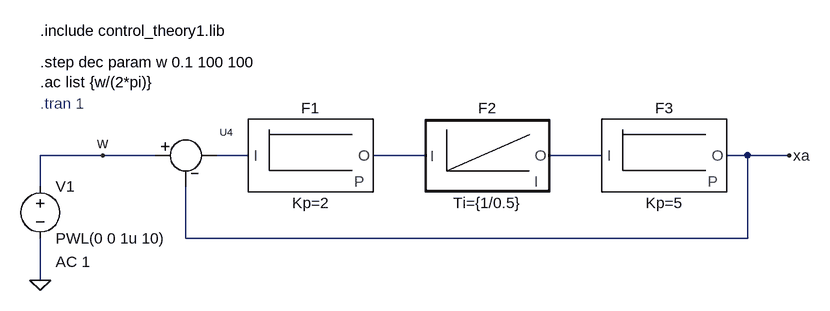
[diagram p0: schematic Aufgabe1_w.asc]
Aufgabe1_w.asc, the LTspice schematic file:
Version 4
SHEET 1 880 680
WIRE -256 128 -352 128
WIRE -176 128 -256 128
WIRE -32 128 -80 128
WIRE 240 128 160 128
WIRE 512 128 432 128
WIRE 736 128 704 128
WIRE 800 128 736 128
WIRE -352 176 -352 128
WIRE -128 256 -128 176
WIRE 736 256 736 128
WIRE 736 256 -128 256
WIRE -352 320 -352 256
FLAG -352 320 0
FLAG 800 128 xa
FLAG -256 128 w
SYMBOL ct___p 64 128 R0
SYMATTR InstName F1
SYMATTR Value Kp=2
SYMBOL ct___p 608 128 R0
SYMATTR InstName F3
SYMATTR Value Kp=5
SYMBOL ct___i 336 128 R0
SYMATTR InstName F2
SYMATTR Value Ti={1/0.5}
SYMBOL ct___sub -128 128 R0
SYMATTR InstName U4
SYMBOL voltage -352 160 R0
WINDOW 123 24 132 Left 0
WINDOW 39 0 0 Left 0
SYMATTR Value2 AC 1
SYMATTR InstName V1
SYMATTR Value PWL(0 0 1u 10)
TEXT -352 48 Left 0 ;.tran 1
TEXT -352 -64 Left 0 !.include control_theory1.lib
TEXT -352 -16 Left 0 !.step dec param w 0.1 100 100\n.ac list {w/(2*pi)}

The netlist it stands for:
* Aufgabe1_w.asc
XF1 N001 N002 CT___P Kp=2  ; pins in out
XF3 N003 xa CT___P Kp=5  ; pins in out
XF2 N002 N003 CT___I Ti={1/0.5}  ; pins in out
XU4 w xa N001 CT___SUB  ; pins inp inm out
V1 w 0 PWL(0 0 1u 10) AC 1
* .tran 1
.include control_theory1.lib
.step dec param w 0.1 100 100
.ac list {w/(2*pi)}
.backanno
.end